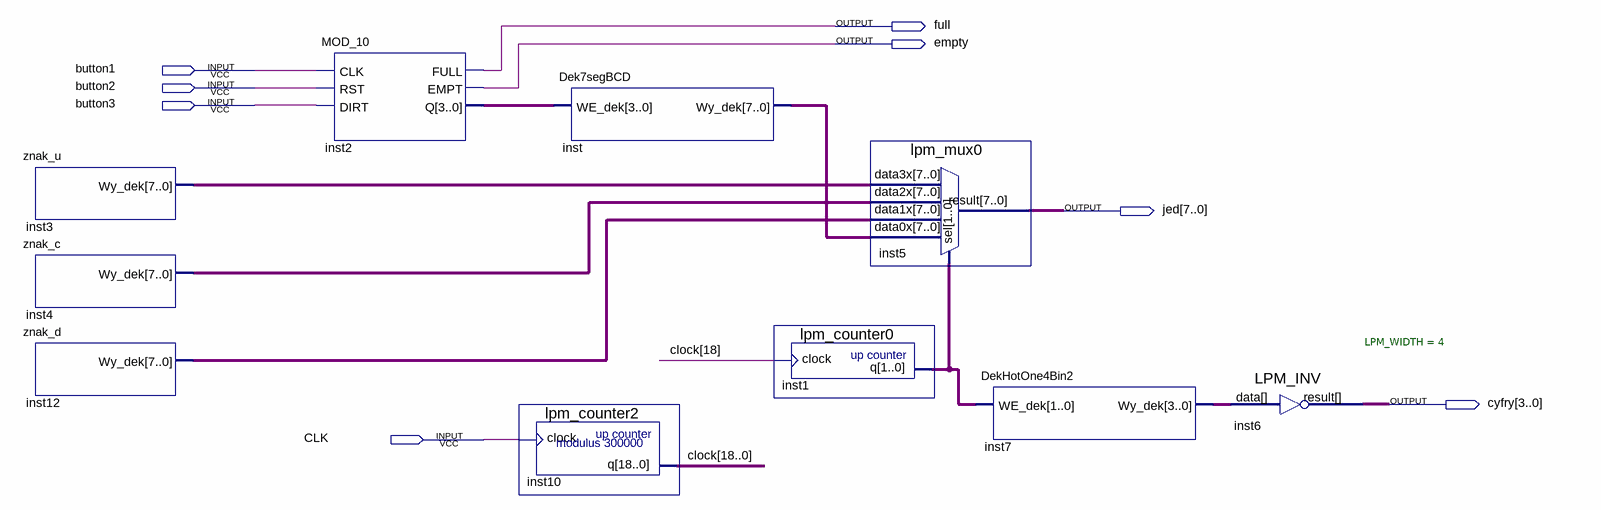
[diagram p0: schematic sheet]
// Quartus schematic p06.bdf as structural Verilog: 10 symbols, 8 pins
module p06 (
  input  button1,
  input  button2,
  input  button3,
  input  CLK,
  output full,
  output empty,
  output [7:0] jed,
  output [3:0] cyfry
);

  wire [1:0] inst1_q;
  wire [3:0] inst2_q, inst7_wy_dek;
  wire [7:0] inst3_wy_dek, inst4_wy_dek, inst12_wy_dek, inst_wy_dek;
  wire [18:0] clock;

  znak_u inst3 (.Wy_dek(inst3_wy_dek));
  znak_c inst4 (.Wy_dek(inst4_wy_dek));
  znak_d inst12 (.Wy_dek(inst12_wy_dek));
  MOD_10 inst2 (.CLK(button1), .RST(button2), .DIRT(button3), .FULL(full), .EMPT(empty), .Q(inst2_q));
  Dek7segBCD inst (.WE_dek(inst2_q), .Wy_dek(inst_wy_dek));
  lpm_counter2 inst10 (.clock(CLK), .q(clock));
  lpm_counter0 inst1 (.clock(clock[18]), .q(inst1_q));
  lpm_mux0 inst5 (
    .data3x(inst3_wy_dek), .data2x(inst4_wy_dek), .data1x(inst12_wy_dek), .data0x(inst_wy_dek),
    .sel(inst1_q), .result(jed));
  DekHotOne4Bin2 inst7 (.WE_dek(inst1_q), .Wy_dek(inst7_wy_dek));
  LPM_INV #(.LPM_WIDTH(4)) inst6 (.data(inst7_wy_dek), .result(cyfry));
endmodule
